# Altium schematic sheet Sheet3.SchDoc
size A4
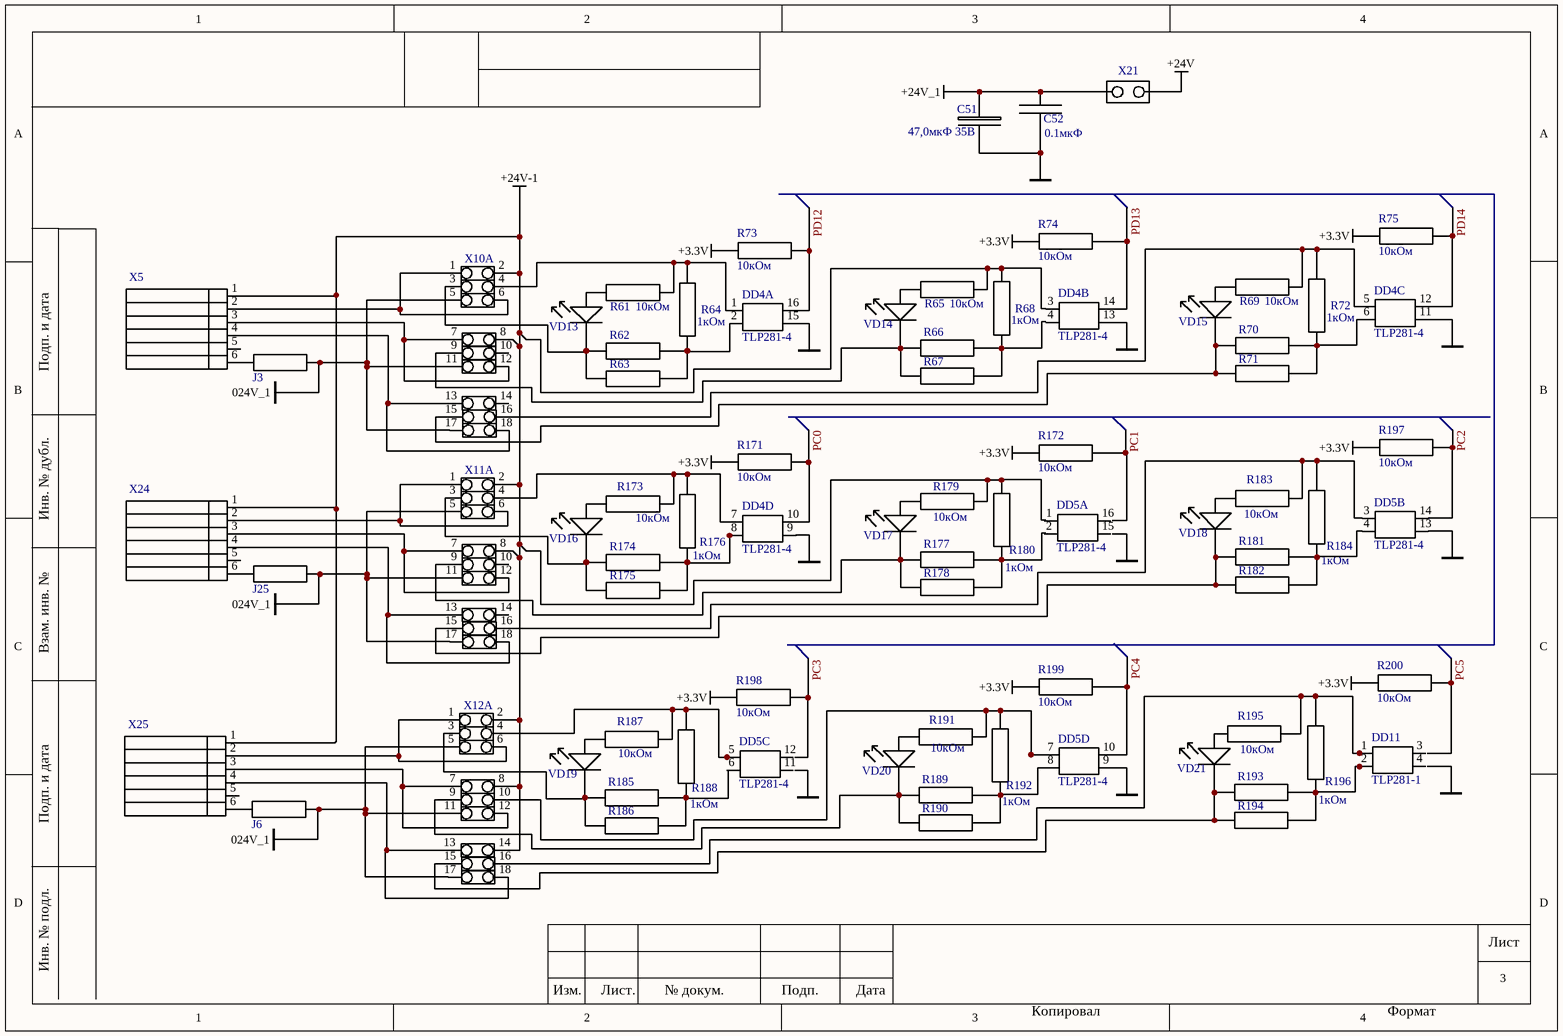
[diagram p0: Sheet3.SchDoc]

## Parts
(Parts that share a designator on the sheet are numbered #1, #2 ... from top to bottom, then left to right.)
*#1  jamp20  (value not drawn)  (part F of 10)
*#2  jamp20  (value not drawn)  (part H of 10)
*#3  jamp20  (value not drawn)  (part H of 10)
C51  C_e  (value not drawn)
C52  C0805  (value not drawn)
DD4  TLP281-4  (parts A,B,C,D of 4)
DD5  TLP281-4  (parts A,B,C,D of 4)
DD11  TLP281-1
J3  R0805  (value not drawn)
J6  R0805  (value not drawn)
J25  R0805  (value not drawn)
R61  R0805  (value not drawn)
R62  R0805  (value not drawn)
R63  R0805  (value not drawn)
R64  R0805  (value not drawn)
R65  R0805  (value not drawn)
R66  R0805  (value not drawn)
R67  R0805  (value not drawn)
R68  R0805  (value not drawn)
R69  R0805  (value not drawn)
R70  R0805  (value not drawn)
R71  R0805  (value not drawn)
R72  R0805  (value not drawn)
R73  R0805  (value not drawn)
R74  R0805  (value not drawn)
R75  R0805  (value not drawn)
R171  R0805  (value not drawn)
R172  R0805  (value not drawn)
R173  R0805  (value not drawn)
R174  R0805  (value not drawn)
R175  R0805  (value not drawn)
R176  R0805  (value not drawn)
R177  R0805  (value not drawn)
R178  R0805  (value not drawn)
R179  R0805  (value not drawn)
R180  R0805  (value not drawn)
R181  R0805  (value not drawn)
R182  R0805  (value not drawn)
R183  R0805  (value not drawn)
R184  R0805  (value not drawn)
R185  R0805  (value not drawn)
R186  R0805  (value not drawn)
R187  R0805  (value not drawn)
R188  R0805  (value not drawn)
R189  R0805  (value not drawn)
R190  R0805  (value not drawn)
R191  R0805  (value not drawn)
R192  R0805  (value not drawn)
R193  R0805  (value not drawn)
R194  R0805  (value not drawn)
R195  R0805  (value not drawn)
R196  R0805  (value not drawn)
R197  R0805  (value not drawn)
R198  R0805  (value not drawn)
R199  R0805  (value not drawn)
R200  R0805  (value not drawn)
VD13  LED  (value not drawn)
VD14  LED  (value not drawn)
VD15  LED  (value not drawn)
VD16  LED  (value not drawn)
VD17  LED  (value not drawn)
VD18  LED  (value not drawn)
VD19  LED  (value not drawn)
VD20  LED  (value not drawn)
VD21  LED  (value not drawn)
X5  PLS-6  (value not drawn)
X10  jamp20  (value not drawn)  (parts A,B,C,D,E,G,I of 10)
X11  jamp20  (value not drawn)  (parts A,B,C,D,E,F,G,I of 10)
X12  jamp20  (value not drawn)  (parts A,B,C,D,E,F,G,H,I of 10)
X21  jamp  (value not drawn)
X24  PLS-6  (value not drawn)
X25  PLS-6  (value not drawn)

## Nets
024V_1: *#1.11 J3.2 J6.2 J25.2 X10.5 X10.17 X11.5 X11.11 X11.17 X12.5 X12.11 X12.17
+3.3V: R73.1 R74.1 R75.1 R171.1 R172.1 R197.1 R198.1 R199.1 R200.1
+24V: X21.2
+24V-1: R65.2 R68.2 R179.2 R180.2 X5.1 X10.2 X10.8 X11.2 X11.8 X12.2 X12.8 X12.14 X24.1 X25.1
+24V_1: C51.1 C52.1 X21.1
GND: C51.2 C52.2 DD4.9 DD4.11 DD4.13 DD4.15 DD5.9 DD5.13
PC1: R172.2
PC3: R198.2
PC4: DD5.10 R199.2
PC5: R200.2
PD12: DD4.16 R73.2
PD14: DD4.12 R75.2
Net*#1_12: *#1.12 X5.3 X10.7
Net*#2_15: *#2.15 R70.1 R71.1 VD15.1(A)
Net*#2_16: *#2.16 DD4.5 R69.2 R72.2
Net*#3_15: *#3.15 R181.1 R182.1 VD18.1(A)
Net*#3_16: *#3.16 DD5.3 R183.2 R184.2
NetDD4_1: DD4.1 R61.2 R64.2 X10.4
NetDD4_2: DD4.2 R62.2 R63.2 R64.1
NetDD4_7: DD4.7 R173.2 R176.2 X11.4
NetDD4_8: DD4.8 R174.2 R175.2 R176.1
NetDD4_10: DD4.10 R171.2
NetDD4_14: DD4.14 R74.2
NetDD5_5: DD5.5 R187.2 R188.2 X12.4
NetDD5_7: DD5.7 R191.2 R192.2 X12.10
NetDD5_8: DD5.8 R189.2 R190.2 R192.1
NetDD5_14: DD5.14 R197.2
NetDD11_1: DD11.1 R195.2 R196.2 X12.16
NetJ3_1: J3.1 X5.6
NetJ6_1: J6.1 X25.6
NetJ25_1: J25.1 X24.6
NetR61_1: R61.1 VD13.2(K)
NetR62_1: R62.1 R63.1 VD13.1(A) X10.3
NetR65_1: R65.1 VD14.2(K)
NetR66_1: R66.1 R67.1 VD14.1(A) X10.9
NetR66_2: R66.2 R67.2 R68.1
NetR69_1: R69.1 VD15.2(K)
NetR70_2: R70.2 R71.2 R72.1
NetR173_1: R173.1 VD16.2(K)
NetR174_1: R174.1 R175.1 VD16.1(A) X11.3
NetR177_1: R177.1 R178.1 VD17.1(A) X11.9
NetR177_2: R177.2 R178.2 R180.1
NetR179_1: R179.1 VD17.2(K)
NetR181_2: R181.2 R182.2 R184.1
NetR183_1: R183.1 VD18.2(K)
NetR185_1: R185.1 R186.1 VD19.1(A) X12.3
NetR185_2: R185.2 R186.2 R188.1
NetR187_1: R187.1 VD19.2(K)
NetR189_1: R189.1 R190.1 VD20.1(A) X12.9
NetR191_1: R191.1 VD20.2(K)
NetR193_1: R193.1 R194.1 VD21.1(A) X12.15
NetR193_2: R193.2 R194.2 R196.1
NetR195_1: R195.1 VD21.2(K)
NetX5_2: X5.2 X10.1 X10.6
NetX5_4: X5.4 X10.13 X10.18
NetX11_1: X11.1 X11.6 X24.2
NetX11_7: X11.7 X11.12 X24.3
NetX11_13: X11.13 X11.18 X24.4
NetX12_1: X12.1 X12.6 X25.2
NetX12_7: X12.7 X12.12 X25.3
NetX12_13: X12.13 X12.18 X25.4

Not connected (* = marked no-connect by the designer): DD4 3 4 6; DD5 1 2 4 6 11 12 15 16; DD11 2 3 4; X5 5; X10 10 14; X11 10 14; X24 5; X25 5

## Notes on the sheet
- 3
- Labels drawn without touching a wire or pin: PC0, PC2, PD13
- Подп. и дата
- Инв. № дубл.
- Взам. инв. №
- Инв. № подл.
- Лист
- Изм.
- Лист.
- № докум.
- Подп.
- Дата
- Копировал
- Формат
- (in symbol C0805) 0.1мкФ
- (in symbol C_e) 47,0мкФ 35В
- (in symbol R0805) 1кОм; 10кОм